# Altium schematic sheet Voltage & Current Sensor V2.SchDoc
size A4
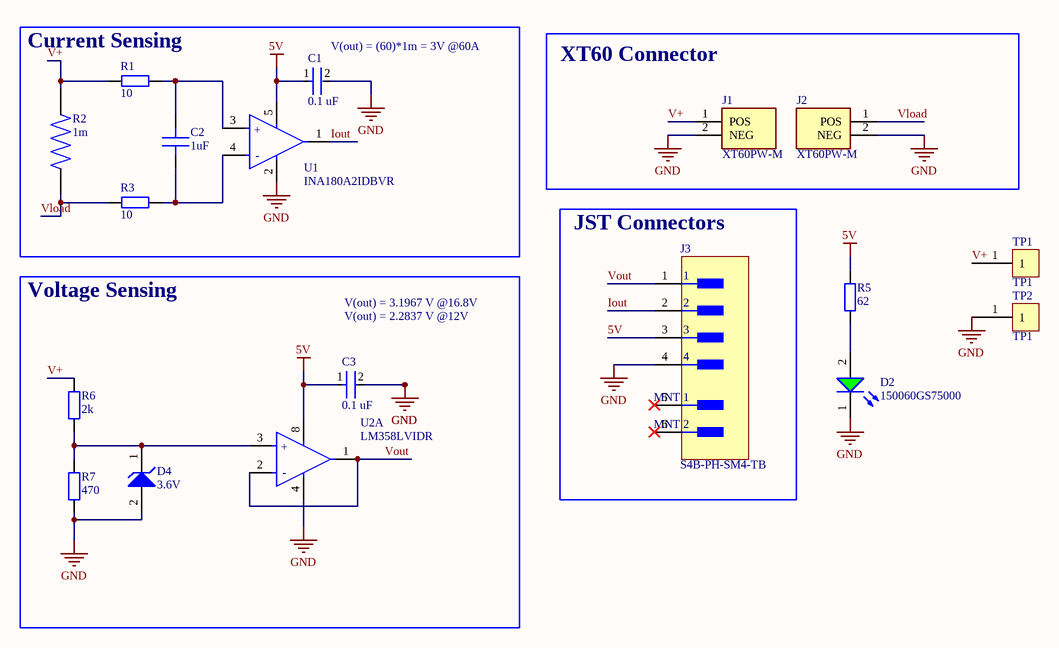
[diagram p0: Voltage & Current Sensor V2.SchDoc]

## Parts
C1  0.1 uF  [FP-CL17-IPC_C]
C2  1uF  [IPC C C0603 NO SILK]
C3  0.1 uF  [FP-CL17-IPC_C]
D2  150060GS75000  [WL-SMCW_0603_150060xx75000]
D4  3.6V  [ONSC-SOD-123-2-425-04_V]
J1  XT60PW-M  [AMASS_XT60PW-M]
J2  XT60PW-M  [AMASS_XT60PW-M]
J3  S4B-PH-SM4-TB  [FP-S4B-PH-SM4-TB-MFG]
R1  10  [IPC C R0603 NO SILK]
R2  1m  [RESC10052X105N]
R3  10  [IPC C R0603 NO SILK]
R5  62  [IPC C R0603 NO SILK]
R6  2k  [IPC C R0402 NO SILK]
R7  470  [IPC C R0402 NO SILK]
TP1  TP1  [TP1]
TP2  TP1  [TP1]
U1  INA180A2IDBVR  [FP-DBV0005A-MFG]
U2  LM358LVIDR  [FP-D0008A-MFG]  (part A of 2)

## Blocks framed on the sheet
Current Sensing: C1 C2 R1-R3 U1
XT60 Connector: J1 J2
JST Connectors: J3
Voltage Sensing: C3 D4 R6 R7 U2

## Nets
5V: C1.1 C3.1 J3.3 R5.2 U1.5(VS) U2.8(V+)
GND: C1.2 C3.2 D2.1(K) D4.2(A) J1.2(NEG) J2.2(NEG) J3.4 R7.1 TP2.1 U1.2(GND) U2.4(V-)
Iout: J3.2 U1.1(OUT)
V+: J1.1(POS) R1.1 R2.2 R6.2 TP1.1
Vload: J2.1(POS) R2.1 R3.1
Vout: J3.1 U2.1(OUT1) U2.2(IN1-)
NetC2_1: C2.1 R3.2 U1.4(IN-)
NetC2_2: C2.2 R1.2 U1.3(IN+)
NetD2_2: D2.2(A) R5.1
NetD4_1: D4.1(K) R6.1 R7.2 U2.3(IN1+)

Not connected (* = marked no-connect by the designer): J3 5(MNT_1)* 6(MNT_2)*

## Notes on the sheet
- (near C1) V(out) = (60)*1m = 3V @60A
- V(out) = 3.1967 V @16.8V
- V(out) = 2.2837 V @12V
- (in symbol CMP-04895-000287-1) +; -
- (in symbol CMP-04895-000442-1, part A) +; -

## Library data of the parts
C1 C3 = CMP-13271-001069-1: Cap Ceramic 100nF 10V X7R ±10% SMD 0402 +125°C Paper T/RCL05B104KP5NNNC; Height: 0.5mm; Case/Package: 0402; Contact Plating: Tin; Case Code (Imperial): 0402; Capacitance: 100nF; Thickness: 0.022inch; Min Operating Temperature: -55°C; Package Quantity: 1; Length: 1mm; Max Operating Temperature: 125°C; Depth: 0.5mm; Voltage Rating: 10V; Packaging: Tape and Reel; Mount: Surface Mount; Tolerance: 10%; Width: 0.02inch; Radiation Hardening: No; Case Code (Metric): 1005; Dielectric: X7R
C2 = CMP-002-000001-1: Generic CAP 0603; Value: ?F; Source: Schlib1.SchLib; Design Item ID: Generic CAP 0603
D2 = CMP-1426-00002-4: 430mcd Colorless transparence 520nm Emerald 140° LED0603 Light Emitting Diodes (LED) ROHS; Peak Wavelength: 515nm; Forward Current: 100mA; Reverse Voltage: 5V; Output Current: 10µA; Power Dissipation: 105mW; Lens Style: Clear, Rectangular; Dominant Wavelength: 525nm; Color: Green; Test Current: 20mA; Max Junction Temperature (Tj): 95°C; Forward Voltage: 3.2V; Width: 800µm; Max Operating Temperature: 85°C; Case Code (Metric): 1608; Luminous Intensity: 430mcd; Lead Free: Lead Free; Case/Package: 0603; Case Code (Imperial): 0603; Mount: Surface Mount; Max Reverse Voltage (DC): 5V; Packaging: Tape and Reel; RoHS: Compliant; Viewing Angle: 140°; REACH SVHC: Unknown; Min Operating Temperature: -40°C; Height: 700µm; Wavelength: 525nm; Length: 1.6mm
D4 = CMP-1060-00574-1: Zener Voltage Regulator, 500 mW, 2-Pin SOD-123, Pb-Free, Tape and Reel. 3.6V breakdown voltage MMSZ4685T1G; Manufacturer: On Semiconductor; VZ Typ (V): 3.6; P Max (W): 0.5; DatasheetVersion: Rev. 9; ComponentLink2Description: Datasheet; Mounting Technology: Surface Mount; ComponentLink3URL: http://www.onsemi.com/pub_link/Collateral/425-04.PDF; ComponentLink3Description: Package Specification; RoHS: Pb-Free; PartNumber: MMSZ4685T1G; ComponentLink1URL: http://www.onsemi.com/; PackageDescription: 2-Pin SOD, Body 1.6 x 2.69 mm; ComponentLink2URL: http://www.onsemi.com/pub_link/Collateral/MMSZ4678T1-D.PDF; ComponentLink1Description: Manufacturer URL; Packing: Tape and Reel; PackageVersion: Rev. G, 10/2009; PackageReference: SOD-123-2-425-04
J1 J2 = CMP-003-000005-1: Socket, DC supply, male, PIN: 2; MF: AMASS; SnapEDA_Link: https://www.snapeda.com/parts/XT60PW-M/AMASS/view-part/?ref=snap; Pin Count: 2; Package: Package; Design Item ID: XT60PW-M; Source: XT60PW-M.SchLib; Component Type: Standard; MP: XT60PW-M; Price: None; Check_prices: https://www.snapeda.com/parts/XT60PW-M/AMASS/view-part/?ref=eda; Availability: Not in stock; Value: *
J3 = CMP-00504-08293667-1: S4B-PH-SM4-TB Header S4B-PH-SM4-TB, 2.00mm, 4-contacts, side entry, SMT, /1000/reel; Max Voltage Rating (DC): 100V; Gender: Male; Number of Contacts: 4; Pitch: 2mm; Max Current Rating: 2A; Contact Resistance: 20mΩ; Termination: Solder; Contact Plating: Copper, Tin; Max Voltage Rating (AC): 100V; Number of Pins: 4; Length: 11.9mm; Housing Color: Beige; RoHS: Non-Compliant; Voltage Rating: 100V; Depth: 7.6mm; Height: 5.5mm; Current Rating: 2A; Max Operating Temperature: 85°C; Min Operating Temperature: -25°C; Number of Rows: 1; Housing Material: Polyamide; Contact Material: Copper, Tin; Packaging: Tape and Reel
R1 R3 R5 = CMP-008-000001-2: Generic RES 0603; Value: ?; Design Item ID: Generic RES 0603; Source: Schlib1.SchLib
R2 = PSR400ITQFH1L00: Res Metal Film 3921 1mOhm 1% 4W Â±75ppm/Â°C Molded SMD Emboss T/R PSR400ITQFH1L00; Package: None; Price: None; Value: *; MP: PSR400ITQFH1L00; Availability: Unavailable
R6 R7 = CMP-008-000000-1: Generic RES 0402; Source: Schlib1.SchLib; Value: ?; Design Item ID: Generic RES 0402
TP1 TP2 = CMP-00003-3: Testpoint double sided
U1 = CMP-04895-000287-1: IC CURR SENSE 1 CIRCUIT SOT23-5 50V/V; Operating Supply Current: 260uA; -3db Bandwidth: 350kHz; Slew Rate: 2V/µs; Number of Circuits: 1; Input Offset Voltage (Vos): 100uV; Input Bias Current: 100nA; Mount: Surface Mount; Max Operating Temperature: 125°C; Packaging: Tape and Reel; Min Operating Temperature: -40°C; Case/Package: SOT-23-5; RoHS Compliant: Yes
U2 = CMP-04895-000442-1: IC OPAMP GP 2 CIRCUIT 8SOIC; Output Current per Channel: 40mA; Input Offset Voltage (Vos): 1mV; Operating Supply Current: 90uA; Number of Circuits: 2; Input Bias Current: 15pA; Slew Rate: 1.5V/µs; Gain Bandwidth Product: 1MHz; Number of Pins: 8; Mount: Surface Mount; Packaging: Cut Tape; RoHS Compliant: Yes; Case/Package: SOIC; Min Operating Temperature: -40°C; Max Operating Temperature: 125°C